# Altium schematic sheet Serial.SchDoc
size A
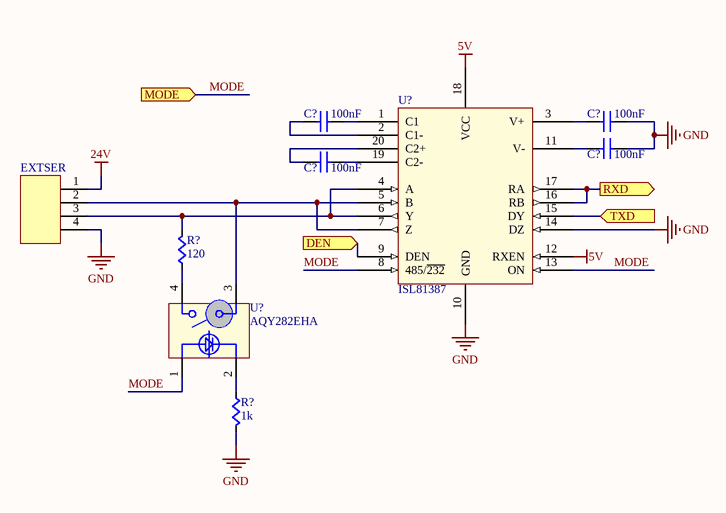
[diagram p0: Serial.SchDoc]

## Parts
(Parts that share a designator on the sheet are numbered #1, #2 ... from top to bottom, then left to right.)
C?#1  value 100nF  [CAPC0603]  (hidden comment: Cap)
C?#2  value 100nF  [CAPC0603]  (hidden comment: Cap)
C?#3  value 100nF  [CAPC0603]  (hidden comment: Cap)
C?#4  value 100nF  [CAPC0603]  (hidden comment: Cap)
EXTSER  MOLEX-HDR-1x4-SHERLOCK_RA  [MOLEX-HDR-1X4-SHERLOCK-RA]  (value not drawn)
R?#1  value 120  [RES0603]  (hidden comment: Res)
R?#2  value 1k  [RES0603]  (hidden comment: Res)
U?#1  ISL81387  [ISL81387IAZ]
U?#2  AQY282EHA  [AQY282EHA]

## Ports
DEN (in), MODE (in), RXD (out), TXD (in)

## Nets
5V: U?#1.12(RXEN) U?#1.18(VCC)
24V: EXTSER.1
GND: C?#2.2(B) C?#3.2(B) EXTSER.4 R?#2.1(A) U?#1.10(GND) U?#1.14(DZ)
DEN: U?#1.9(DEN) ; port DEN
MODE: U?#1.8(485/~{232}) U?#1.13(ON) U?#2.1(A) ; port MODE
RXD: U?#1.16(RB) U?#1.17(RA) ; port RXD
TXD: U?#1.15(DY) ; port TXD
NetC?#1_1: C?#1.1(A) U?#1.2(C1-)
NetC?#1_2: C?#1.2(B) U?#1.1(C1)
NetC?#2_1: C?#2.1(A) U?#1.3(V+)
NetC?#3_1: C?#3.1(A) U?#1.11(V-)
NetC?#4_1: C?#4.1(A) U?#1.20(C2+)
NetC?#4_2: C?#4.2(B) U?#1.19(C2-)
NetEXTSER_2: EXTSER.2 U?#1.5(B) U?#1.7(Z) U?#2.3(S2)
NetEXTSER_3: EXTSER.3 R?#1.1(A) U?#1.4(A) U?#1.6(Y)
NetR?#1_2: R?#1.2(B) U?#2.4(S1)
NetR?#2_2: R?#2.2(B) U?#2.2(C)

## Library data of the parts
EXTSER = MOLEX-HDR-1x4-SHERLOCK_RA: Header, Molex, 2mm Pitch Sherlock Header, Single Row, Horizontal, 4 Circuits, Length 3.3mm; Manufacturer Part Number: 0353630460; Supplier Part Number: WM18933-ND; Manufacturer: Molex; Supplier: Digikey
U?#1 = ISL81387: 5V RS-232/RS-485 Transceiver; Supplier 1: Digi-Key; Supplier Part Number 1: ISL81387IAZ-TCT-ND
U?#2 = AQY282EHA: PhotoMOS Solid State Relay; Supplier 1: Digi-Key; Supplier Part Number 1: AQY282EHA-ND
C?#1-C?#4 = Cap: Supplier 1: Digi-Key; Supplier Part Number 1: 1276-1000-1-ND
R?#1 R?#2 = Res: Supplier 1: Digi-Key
  R?#1: Supplier Part Number 1: RMCF0603JT10K0CT-ND
  R?#2: Supplier Part Number 1: RHM1.0KGCT-ND